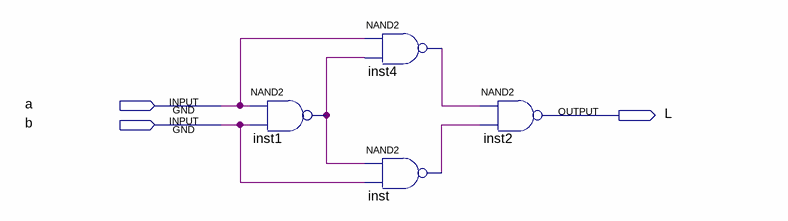
[diagram p0: schematic sheet]
// Quartus schematic nandgates.bdf as structural Verilog: 4 symbols, 3 pins
module nandgates (
  input  a,
  input  b,
  output L
);

  wire inst1_out, inst4_out, inst_out;

  nand inst1 (inst1_out, a, b);
  nand inst4 (inst4_out, a, inst1_out);
  nand inst (inst_out, inst1_out, b);
  nand inst2 (L, inst4_out, inst_out);
endmodule
